# EAGLE design BareBones-Arduino (EAGLE 6.6.0)
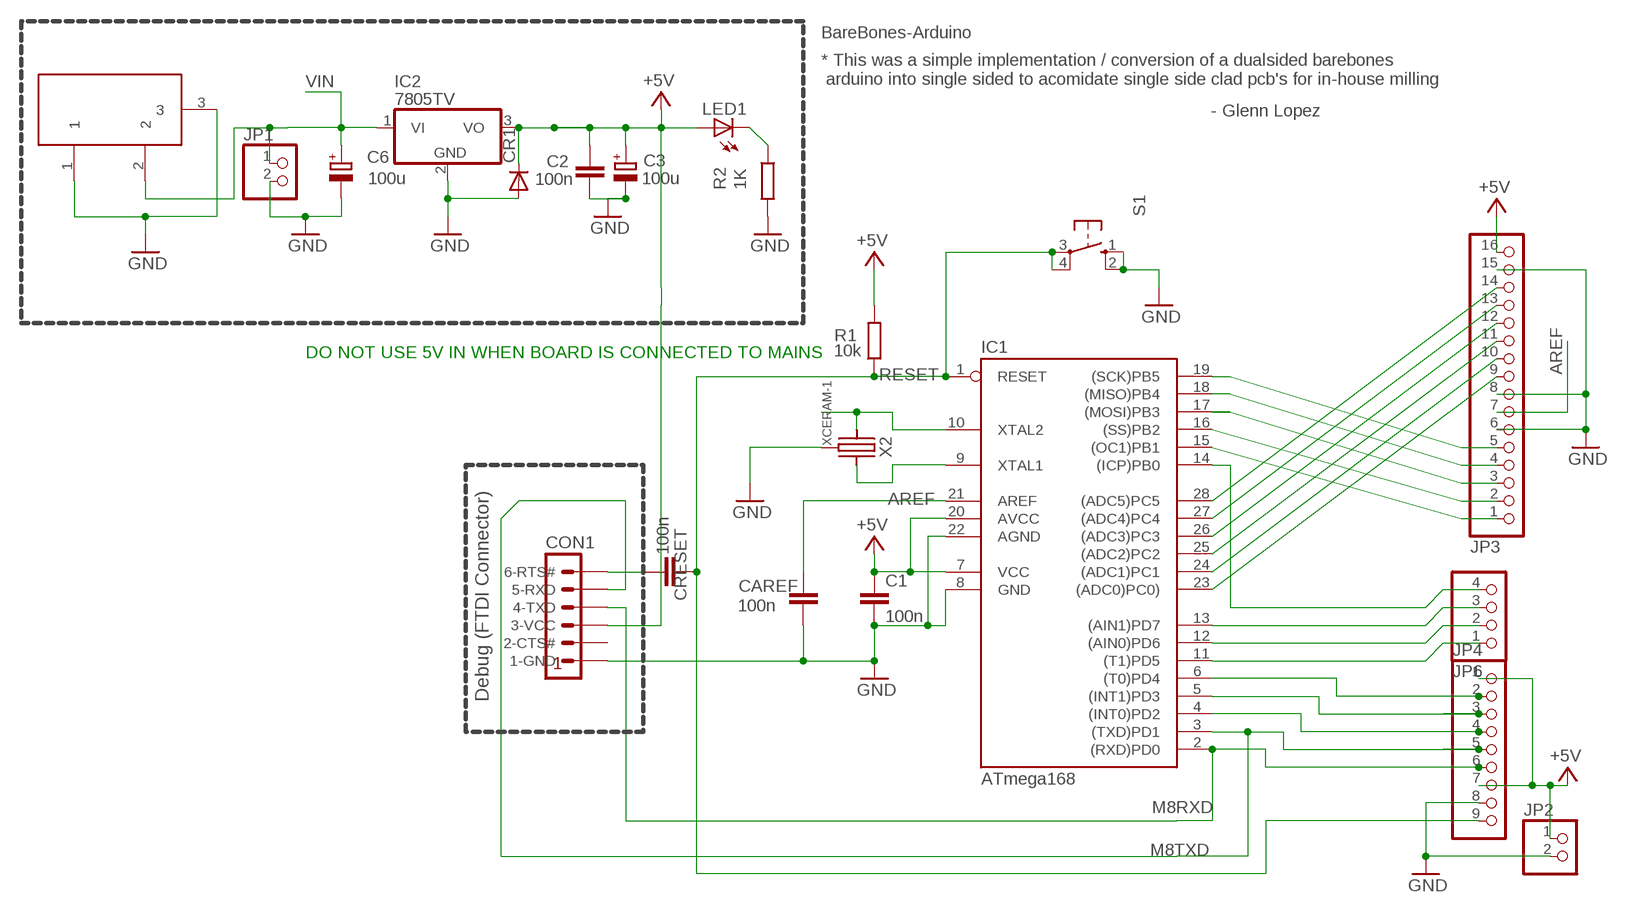
[diagram p0: schematic, sheet 1]

## Parts
C1  100n  C-EU025-025X050  [C025-025X050]
C2  100n  C-EUC1206K  [C1206K]
C3  100u  CPOL-EUE2.5-7  [E2,5-7]
C6  100u  CPOL-EUE2.5-7  [E2,5-7]
CAREF  100n  C-EUC1206K  [C1206K]
CON1  FTDI-TTL232R  [MA06-1]
CR1  DIODE-1ARECT-2V  [DO41-2V]
CRESET  100n  C-EU025-025X050  [C025-025X050]
IC1  ATmega168  AT90S4433P  [DIL28-3]
IC2  7805TV  [TO220V]
JP1  PINHD-1X2  [1X02]
JP2  PINHD-1X2  [1X02]
JP3  PINHD-1X16-BARE  [1X16-BARE]
JP4  PINHD-1X9-BARE  [1X09-BARE]
JP6  PINHD-1X4-BARE  [1X04-BARE]
LED1  LED3MM  [LED3MM]
R1  10k  R-EU_0204/5  [0204/5]
R2  1K  R-EU_0204/5  [0204/5]
S1  10-XX  [B3F-10XX]
X2  XCERAM-1  [XTAL-3]
X3  DC-In  POWERSUPPLY_DC21MM4UCON  [4UCON-POWER-JACK]

## Nets
+5V [power]: C1.1 C2.2 C3.+ CON1.3(3-VCC) CR1.C IC1.7(VCC) IC1.20(AVCC) IC2.3(VO) JP2.1 JP3.16 JP4.1 JP4.7 LED1.A R1.2
AREF: CAREF.2 IC1.21(AREF) JP3.7
GND [power]: C1.2 C2.1 C3.- C6.- CAREF.1 CON1.1(1-GND) CR1.A IC1.8(GND) IC1.22(AGND) IC2.2(GND) JP1.2 JP2.2 JP3.6 JP3.8 JP3.15 JP4.8 R2.2 S1.1(S) S1.2(S1) X2.P$2(GND) X3.1 X3.3
M8RXD: CON1.4(4-TXD) IC1.2((RXD)PD0) JP4.6
M8TXD: CON1.5(5-RXD) IC1.3((TXD)PD1) JP4.5
N$1: IC1.18((MISO)PB4) JP3.4
N$2: LED1.K(C) R2.1
N$3: IC1.24((ADC1)PC1) JP3.10
N$4: IC1.17((MOSI)PB3) JP3.3
N$5: IC1.11((T1)PD5) JP6.1
N$6: IC1.9(XTAL1) X2.P$3
N$7: IC1.10(XTAL2) X2.P$1
N$8: CON1.6(6-RTS#) CRESET.1
N$10: IC1.4((INT0)PD2) JP4.4
N$11: IC1.5((INT1)PD3) JP4.3
N$12: IC1.6((T0)PD4) JP4.2
N$13: IC1.12((AIN0)PD6) JP6.2
N$14: IC1.13((AIN1)PD7) JP6.3
N$15: IC1.14((ICP)PB0) JP6.4
N$16: IC1.15((OC1)PB1) JP3.1
N$17: IC1.16((SS)PB2) JP3.2
N$18: IC1.23((ADC0)PC0)) JP3.9
N$19: IC1.25((ADC2)PC2) JP3.11
N$20: IC1.26((ADC3)PC3) JP3.12
N$21: IC1.27((ADC4)PC4) JP3.13
N$22: IC1.28((ADC5)PC5) JP3.14
RESET: CRESET.2 IC1.1(RESET) JP4.9 R1.1 S1.3(P) S1.4(P1)
SCK: IC1.19((SCK)PB5) JP3.5
VIN [power]: C6.+ IC2.1(VI) JP1.1 X3.2
Unconnected: CON1.2(2-CTS#)

## Notes on the sheet
- BareBones-Arduino
- * This was a simple implementation / conversion of a dualsided barebones
   arduino into single sided to acomidate single side clad pcb's for in-house milling
- - Glenn Lopez
- DO NOT USE 5V IN WHEN BOARD IS CONNECTED TO MAINS
- Debug (FTDI Connector)

## Library data of the parts
C1 C2 CAREF CRESET = my-rcl:C-EU: CAPACITOR, European symbol
C3 C6 = my-rcl:CPOL-EU: POLARIZED CAPACITOR, European symbol
CON1 = mylib4:FTDI-TTL232R: FTDI USB to serial (TTL level) cable
CR1 = mylib4:DIODE-1ARECT
IC1 = atmel:AT90S4433: MICROCONTROLLER 4 Kbytes FLASH 128 bytes SRAM 256 bytes EEPROM UART 6-channel 10 bit ADC
IC2 = linear:78*: Positive VOLTAGE REGULATOR Source: http://cache.national.com/ds/LM/LM78L05.pdf http://www.fairchildsemi.com/ds/LM/LM7805.pdf
JP1 JP2 = pinhead:PINHD-1X2: PIN HEADER
JP3 = pinhead:PINHD-1X16: PIN HEADER
JP4 = pinhead:PINHD-1X9: PIN HEADER
JP6 = pinhead:PINHD-1X4: PIN HEADER
LED1 = led:LED: LED OSRAM: - CHIPLED LG R971, LG N971, LY N971, LG Q971, LY Q971, LO R971, LY R971 LH N974, LH R974 LS Q976, LO Q976, LY Q976 LO Q996 - Hyper CHIPLED LW Q18S LB Q993, LB Q99A, LB R99A - SideLED LS A670, LO A670, LY A670, LG A670, LP A670 LB A673, LV A673, LT A673, LW A673 LH A674 LY A675 LS A676, LA A676, LO A676, LY A676, LW A676 LS A679, LY A679, LG A679 - Hyper Micro SIDELED® LS Y876, LA Y876, LO Y876, LY Y876 LT Y87S - SmartLED LW L88C, LW L88S LB L89C, LB L89S, LG L890 LS L89K, LO L89K, LY L89K LS L896, LA L896, LO L896, LY L896 - TOPLED LS T670, LO T670, LY T670, LG T670, LP T670 LSG T670, LSP T670, LSY T670, LOP T670, LYG T670 LG T671, LOG T671, LSG T671 LB T673, LV T673, LT T673, LW T673 LH T674 LS T676, LA T676, LO T676, LY T676, LB T676, LH T676, LSB T676, LW T676 LB T67C, LV T67C, LT T67C, LS T67K, LO T67K, LY T67K, LW E67C LS E67B, LA E67B, LO E67B, LY E67B, LB E67C, LV E67C, LT E67C LW T67C LS T679, LY T679, LG T679 LS T770, LO T770, LY T770, LG T770, LP T770 LB T773, LV T773, LT T773, LW T773 LH T774 LS E675, LA E675, LY E675, LS T675 LS T776, LA T776, LO T776, LY T776, LB T776 LHGB T686 LT T68C, LB T68C - Hyper Mini TOPLED® LB M676 - Mini TOPLED Santana® LG M470 LS M47K, LO M47K, LY M47K Source: http://www.osram.convergy.de - LUMILED® LXK2-PW12-R00, LXK2-PW12-S00, LXK2-PW14-U00, LXK2-PW14-V00 LXK2-PM12-R00, LXK2-PM12-S00, LXK2-PM14-U00 LXK2-PE12-Q00, LXK2-PE12-R00, LXK2-PE12-S00, LXK2-PE14-T00, LXK2-PE14-U00 LXK2-PB12-K00, LXK2-PB12-L00, LXK2-PB12-M00, LXK2-PB14-N00, LXK2-PB14-P00, LXK2-PB14-Q00 LXK2-PR12-L00, LXK2-PR12-M00, LXK2-PR14-Q00, LXK2-PR14-R00 LXK2-PD12-Q00, LXK2-PD12-R00, LXK2-PD12-S00 LXK2-PH12-R00, LXK2-PH12-S00 LXK2-PL12-P00, LXK2-PL12-Q00, LXK2-PL12-R00 Source: www.luxeon.com
R1 R2 = my-rcl:R-EU_: RESISTOR, European symbol
S1 = switch-omron:10-XX: OMRON SWITCH
X2 = mylib4:XCERAM: Ceramic resonator with built-in caps
X3 = mylib4:POWERSUPPLY_DC21MM

## Net classes
0 default: width 0.4 mm, clearance 0.3 mm
1 power: width 0.6 mm, clearance 0.3 mm

## Board
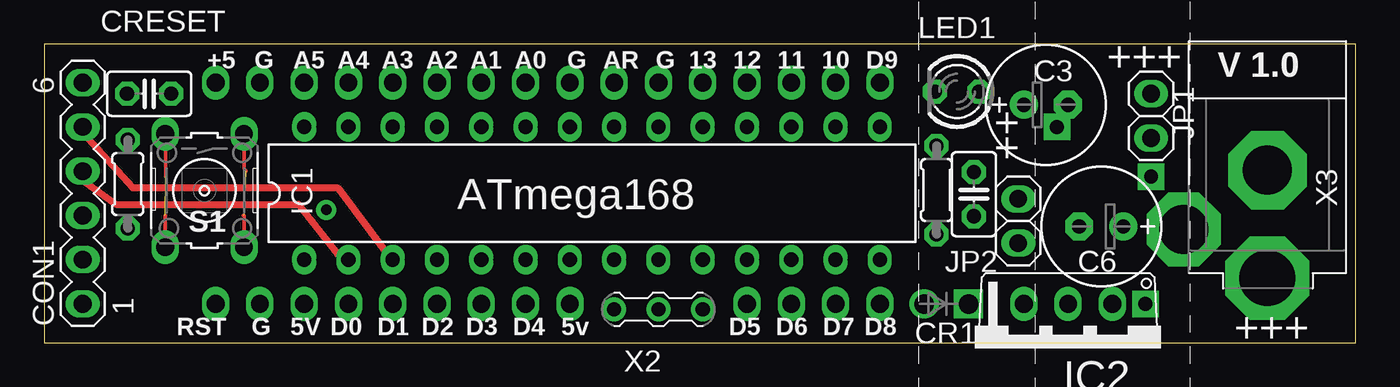
[diagram p1: board, top side]
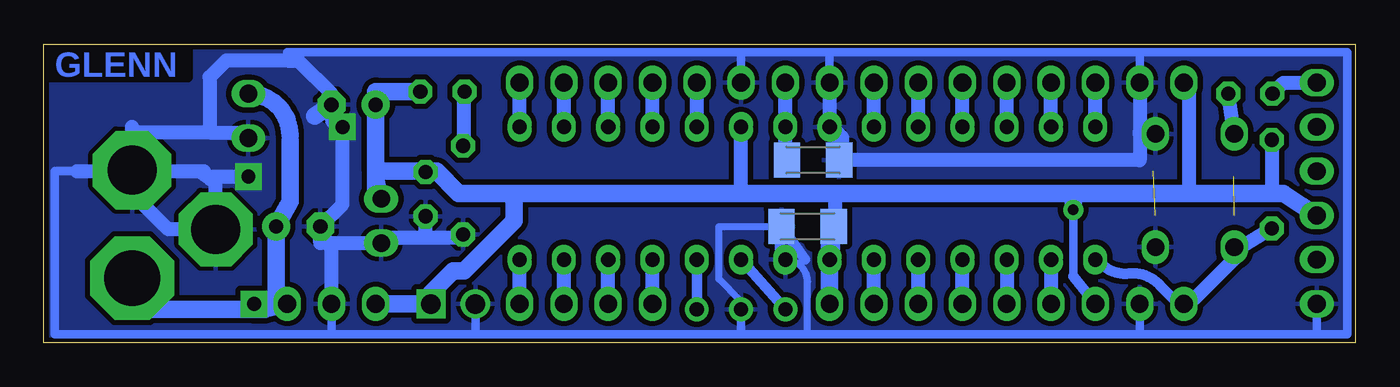
[diagram p2: board, bottom side, seen from below]

Size 75.25 x 17.15 mm. Coordinates in mm from the lower left corner, seen from the top.
Outline: 0,0 75.25,0 75.25,17.15 0,17.15 0,0
Copper layers (1*16): Top 0.035mm / dielectric 1.5mm / Bottom 0.035mm
Design rules "default *": minimum track width 10mil, minimum drill 0.8mm, track to track 0.3mm, track to pad 0.3mm, pad to pad 0.3mm, via to via 8mil, smd to smd 8mil, copper to edge 6mil, drill to drill 8mil, minimum pad ring 11mil, minimum via ring 8mil, stop-mask expansion 4mil, vias tented up to drill 0mil, thermal gap 10mil
bRestrict: 5 lines

### Footprints (pad centres in the part's own frame; a part is rotated, then mirrored left to right if it is on the bottom)
C025-025X050@1 = drill 0.813 octagon: 1 -1.27,0; 2 1.27,0
C1206K@1 = smd 1.5 x 2: 1 -1.5,0; 2 1.5,0
E2,5-7@1 = drill 0.813 pad 1.6: + -1.27,0 | drill 0.813 pad 1.6 octagon: - 1.27,0
MA06-1 = drill 1.016 long: 1 -6.35,0; 2 -3.81,0; 3 -1.27,0; 4 1.27,0; 5 3.81,0; 6 6.35,0
DO41-2V = drill 1.118: A 1.27,0 | drill 1.118 square: C -1.27,0
DIL28-3 = drill 0.813 long: 1 -16.51,-3.81; 2 -13.97,-3.81; 3 -11.43,-3.81; 4 -8.89,-3.81; 5 -6.35,-3.81; 6 -3.81,-3.81; 7 -1.27,-3.81; 8 1.27,-3.81; 9 3.81,-3.81; 10 6.35,-3.81; 11 8.89,-3.81; 12 11.43,-3.81; 13 13.97,-3.81; 14 16.51,-3.81; 15 16.51,3.81; 16 13.97,3.81; 17 11.43,3.81; 18 8.89,3.81; 19 6.35,3.81; 20 3.81,3.81; 21 1.27,3.81; 22 -1.27,3.81; 23 -3.81,3.81; 24 -6.35,3.81; 25 -8.89,3.81; 26 -11.43,3.81; 27 -13.97,3.81; 28 -16.51,3.81
TO220V = drill 1.016 long: 1 -2.54,-2.54; 2 0,-2.54; 3 2.54,-2.54
1X02 = drill 1.016 long: 1 -1.27,0; 2 1.27,0
1X16-BARE = drill 1.016 long: 1 -19.05,0; 2 -16.51,0; 3 -13.97,0; 4 -11.43,0; 5 -8.89,0; 6 -6.35,0; 7 -3.81,0; 8 -1.27,0; 9 1.27,0; 10 3.81,0; 11 6.35,0; 12 8.89,0; 13 11.43,0; 14 13.97,0; 15 16.51,0; 16 19.05,0
1X09-BARE = drill 1.016 long: 1 -10.16,0; 2 -7.62,0; 3 -5.08,0; 4 -2.54,0; 5 0,0; 6 2.54,0; 7 5.08,0; 8 7.62,0; 9 10.16,0
1X04-BARE = drill 1.016 long: 1 -3.81,0; 2 -1.27,0; 3 1.27,0; 4 3.81,0
LED3MM = drill 0.813 octagon: A -1.27,0; K 1.27,0
0204/5 = drill 0.813 octagon: 1 -2.54,0; 2 2.54,0
B3F-10XX = drill 1.016 long: 1 -3.251,2.261; 2 3.251,2.261; 3 -3.251,-2.261; 4 3.251,-2.261
XTAL-3 = drill 0.813: P$1 0,2.54; P$2 0,0; P$3 0,-2.54
4UCON-POWER-JACK = drill 2.8 pad 4.25 octagon: 1 -4.8,-3.18 | drill 3.2 pad 4.8 octagon: 2 0,-5.98 | drill 2.8 pad 4.5 octagon: 3 0,0.22

### Placement (x,y rotation side)
C1  100n  [C025-025X050@1]  53.33,8.52 270 top
C2  100n  [C1206K@1]  31.43,6.67 0 bottom
C3  100u  [E2,5-7@1]  57.47,13.65 0 top
C6  100u  [E2,5-7@1]  60.64,6.67 180 top
CAREF  100n  [C1206K@1]  31.11,10.48 180 bottom
CON1  2.22,8.57 90 top
CR1  51.75,2.22 180 top
CRESET  100n  [C025-025X050@1]  6.03,14.29 0 top
IC1  31.43,8.57 0 top
IC2  58.74,-0.32 180 top
JP1  63.5,13.02 270 top
JP2  55.88,6.99 270 top
JP3  28.89,14.92 180 top
JP4  20,2.22 180 top
JP6  44.13,2.22 0 top
LED1  52.37,14.41 180 top
R1  4.81,9.1 90 top
R2  51.19,8.76 270 top
S1  9.21,8.73 270 top
X2  35.24,1.9 270 top
X3  70.17,9.68 0 top

### Tracks (layer width: path | path; a pad name or v marks a point on that pad's centre or on a via)
+5V  (via drill 0.6)
  Bottom 0.5: 16.19,3.81 16.19,5.4 v16.19,7.62 16.19,8.26
  Bottom 0.6: C2.2 29.85,6.03 29.85,5.4 IC1.7 | 16.19,3.81 JP4.7 | 30.16,2.86 JP4.1 | 16.19,8.57 16.19,8.26
  Bottom 0.8: 53.66,9.84 53.66,9.79 C1.1 | 29.85,6.76 C2.2 29.85,6.76 | R1.2 4.76,11.6 4.76,8.57 | JP3.16 9.53,14.6 9.53,8.57 | 29.85,8.57 29.85,6.76 | 35.24,8.57 IC1.20 | 56.2,9.84 JP2.1 56.2,9.84
  Bottom 1: 30.16,5.72 IC1.7 30.16,4.13 30.16,2.86 | 53.66,9.84 C1.1 53.66,9.8 53.66,9.84 | LED1.A 56.2,14.41 C3.+ 56.2,9.84 | 53.66,9.84 56.2,9.84 | 56.2,9.84 56.2,8.57 JP2.1 | IC2.3 CR1.C 53.02,2.86 51.75,4.13 51.12,4.13 48.26,6.99 48.26,8.57 | CON1.3 4.13,8.57 4.76,8.57 9.53,8.57 16.19,8.57 29.85,8.57 35.24,8.57 48.26,8.57 | 48.26,8.57 51.43,8.57 52.71,9.84 53.66,9.84 | 16.19,8.26 v16.19,7.62
AREF
  Bottom 0.4: CAREF.2 32.7,10.48
  Bottom 0.8: 32.7,10.48 32.7,11.75 IC1.21 32.7,13.02 32.7,14.29 JP3.7
GND  (via drill 0.8)  (1 unrouted)
  Top 0.2: 11.43,5.48 S1.2 11.47,7.3 11.43,7.3 | S1.1 11.47,9.96 11.59,9.84
  Bottom 0.4: IC1.8 arc90 31.43,3.49 31.43,0.48 | X2.P$2 35.24,2.38 36.51,3.65 36.51,6.67 32.86,6.67 32.7,6.51
  Bottom 0.5: CON1.1 2.22,0.48 2.38,0.48 | 2.54,0.48 2.38,0.48 | 2.54,0.48 12.38,0.48 | 12.38,0.48 12.38,2.06 JP4.8 12.38,0.48 | 12.38,0.48 31.43,0.48 35.24,0.48 | 35.24,0.48 50.48,0.48 | 50.48,0.48 58.74,0.48 | IC2.2 58.58,2.22 IC2.2 | 58.74,0.48 IC2.2 | 50.48,0.48 50.48,0.79 CR1.A | 35.24,0.48 35.24,0.63 X2.P$2 | C2.1 32.93,6.83 32.86,6.83 32.7,6.83 32.7,6.51 32.7,6.35 | 61.28,16.19 61.28,16.67 35.24,16.67 | 30.16,16.67 30.16,16.51 | 30.16,16.51 JP3.8 | 30.16,16.67 35.24,16.67 | 35.24,16.67 35.24,16.51 JP3.6 | 30.16,16.67 30.16,16.51 | 12.38,16.67 0.48,16.67 0.48,0.48 2.38,0.48 | 12.38,16.67 30.16,16.67 | 2.54,0.48 2.38,0.48 | 58.74,0.48 74.61,0.48 74.61,9.84 73.5,9.84 73.34,9.84 | JP3.15 12.38,16.51 12.38,16.67
  Bottom 0.6: C2.1 33.02,6.03 33.02,5.4 IC1.8 | 32.7,6.35 31.59,4.76
  Bottom 0.8: 66.36,9.84 66.04,9.84 | 73.34,9.84 66.36,9.84 | 70.17,12.06 70.17,10.48 | 70.17,12.06 70.17,12.38 | JP3.8 IC1.22 | JP1.2 63.82,12.06 65.72,12.06 | 65.72,12.06 70.17,12.06 | 65.77,9.45 65.4,9.21 65.4,6.67 65.37,6.63 X3.1 68.1,6.5 70.17,8.57 | 66.36,9.84 65.77,9.45 | 65.77,9.45 65.72,9.53 v63.5,9.53 | IC2.2 58.74,5.72 | 58.74,5.72 JP2.2 55.88,6.03 55.56,6.03 53.34,6.03 | 58.74,5.72 59.06,5.72 59.37,5.72 C6.- 58.1,7.94 v58.1,12.38 arc90 58.74,13.02 C3.- 58.74,14.29 60.64,16.19 61.28,16.19 64.77,16.19 65.72,15.24 65.72,12.06 | R2.2 51.19,6.03 53.34,6.03 | C1.2 53.33,6.03 53.34,6.03 | 70.17,10.48 X3.3 | 70.17,10.48 | CAREF.1 29.53,10.48 12.38,10.48 12.38,12.06 | S1.1 12.38,11.98 12.38,12.06 | JP3.15 12.38,12.06
  Bottom 1: C3.- 59.69,13.02 | IC1.22 29.53,11.75 29.53,10.48
  pour Bottom (isolate 0.305): -1.27,17.94 -1.27,-1.9 76.52,-1.9 76.52,17.94
M8RXD
  Top 0.4: CON1.4 2.54,9.53 1.91,9.53 4.13,7.94 14.61,7.94 16.83,5.08 IC1.2
  Bottom 0.8: IC1.2 JP4.6
M8TXD
  Top 0.4: CON1.5 2.22,12.06 5.08,8.89 16.83,8.89 19.68,5.08 IC1.3
  Bottom 0.8: IC1.3 JP4.5
N$1
  Bottom 0.8: IC1.18 JP3.4
N$2
  Bottom 0.8: LED1.K 51.12,14.41 51.12,14.29 51.12,11.3 R2.1
N$3
  Bottom 0.8: IC1.24 25.08,13.02 25.08,14.29 JP3.10
N$4
  Bottom 0.8: IC1.17 JP3.3
N$5
  Bottom 0.8: JP6.1 IC1.11
N$6
  Bottom 0.6: X2.P$3 IC1.9
N$7
  Bottom 0.6: X2.P$1 IC1.10
N$8
  Bottom 0.8: CRESET.1 4.13,14.92 CON1.6
N$10
  Bottom 0.8: JP4.4 IC1.4
N$11
  Bottom 0.8: JP4.3 IC1.5
N$12
  Bottom 0.8: JP4.2 IC1.6
N$13
  Bottom 0.6: 42.86,4.13 IC1.12
  Bottom 0.8: JP6.2 42.86,4.13
N$14
  Bottom 0.8: JP6.3 IC1.13
N$15
  Bottom 0.8: JP6.4 IC1.14
N$16
  Bottom 0.8: IC1.15 JP3.1
N$17
  Bottom 0.8: IC1.16 JP3.2
N$18
  Bottom 0.8: IC1.23 27.62,13.02 27.62,14.29 JP3.9
N$19
  Bottom 0.8: IC1.25 22.54,13.02 22.54,14.29 JP3.11
N$20
  Bottom 0.8: IC1.26 20,13.02 20,14.29 JP3.12
N$21
  Bottom 0.8: IC1.27 17.46,13.02 17.46,14.29 JP3.13
N$22
  Bottom 0.8: IC1.28 14.92,13.02 14.92,14.29 JP3.14
RESET  (1 unrouted)
  Top 0.2: 6.98,5.4 6.98,5.48 S1.4 6.95,7.3 6.98,7.3 | S1.3 6.98,11.98 6.98,9.53
  Bottom 0.6: IC1.1 14.19,4.21 arc-37 12.99,3.97 12.58,3.97 arc45 11.16,3.22 10.48,2.54 JP4.9
  Bottom 0.8: JP4.9 9.21,2.54 6.98,4.76 S1.4 6.67,5.4 R1.1 | S1.3 CRESET.2
SCK
  Bottom 0.8: IC1.19 JP3.5
VIN  (via drill 0.8)
  Bottom 0.8: 61.12,11.59 61.12,11.91 | 63.18,1.9 v63.18,2.22
  Bottom 1: X3.2 69.74,2.12 69.53,1.9 63.18,1.9 62.55,1.9 IC2.1 61.91,2.22 C6.+ 61.12,8.1 61.12,11.59 | 61.12,11.91 arc-90 JP1.1

### Text on the board
Bottom: GLENN
tPlace: +++ | V 1.0 | ++ | +++
tNames: +5 | G | A5 | A4 | A3 | A2 | A1 | A0 | G | AR | G | 13 | 12 | 11 | 10 | D9 | RST | G | 5V | D0 | D1 | D2 | D3 | D4 | 5v | D5 | D6 | D7 | D8
Edit History: connection provided by switch internals | Optional SMT C-aref | Jumpers | Optional SMT C-byp | BareBones-Arduino (single side) | By: Glenn Lopez